# EasyEDA Pro project flopperone.epro

# Schematic Schematic1

## Sheets
1 RP2040: Board Name: Main board; Create Date: 2025-09-06; Page Name: RP2040; Project Name: flopperone; Schematic Name: Schematic1; Update Date: 2025-09-07; Company: EasyEDA.com; Page Size: A4; Version: V1.0
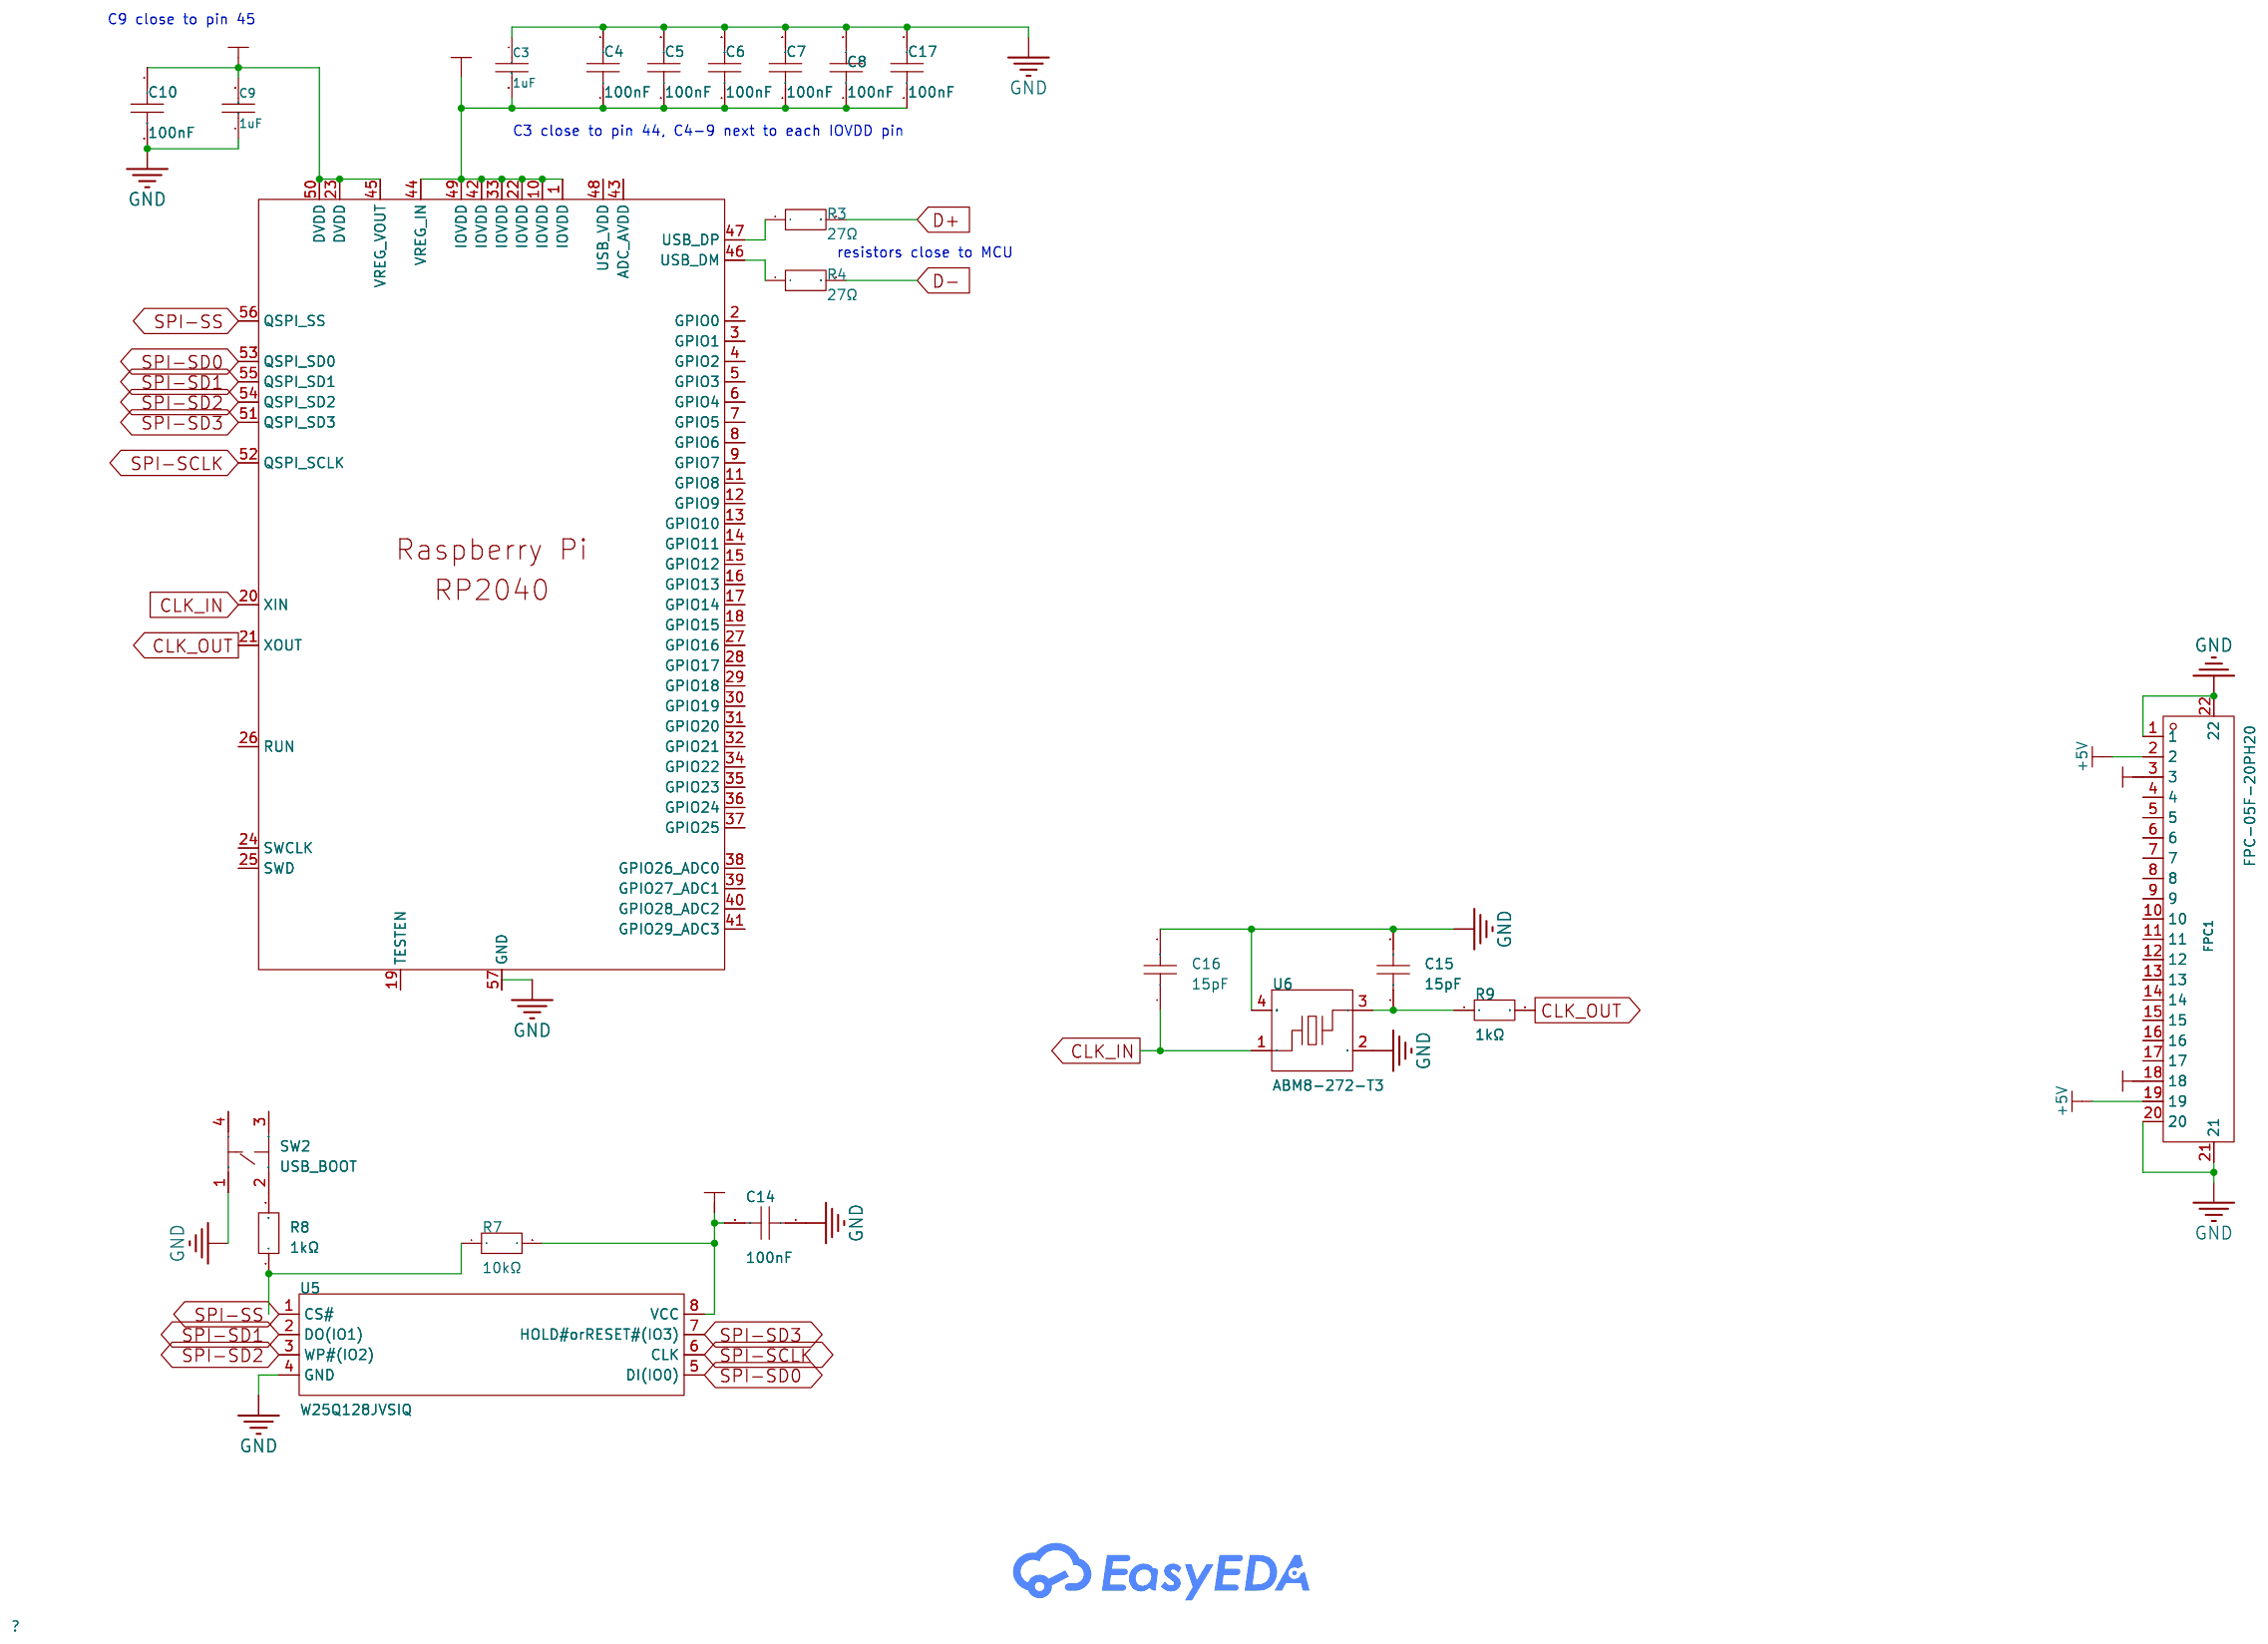
[diagram p0: RP2040]
2 Power: Create Date: 2025-09-07; Page Name: Power
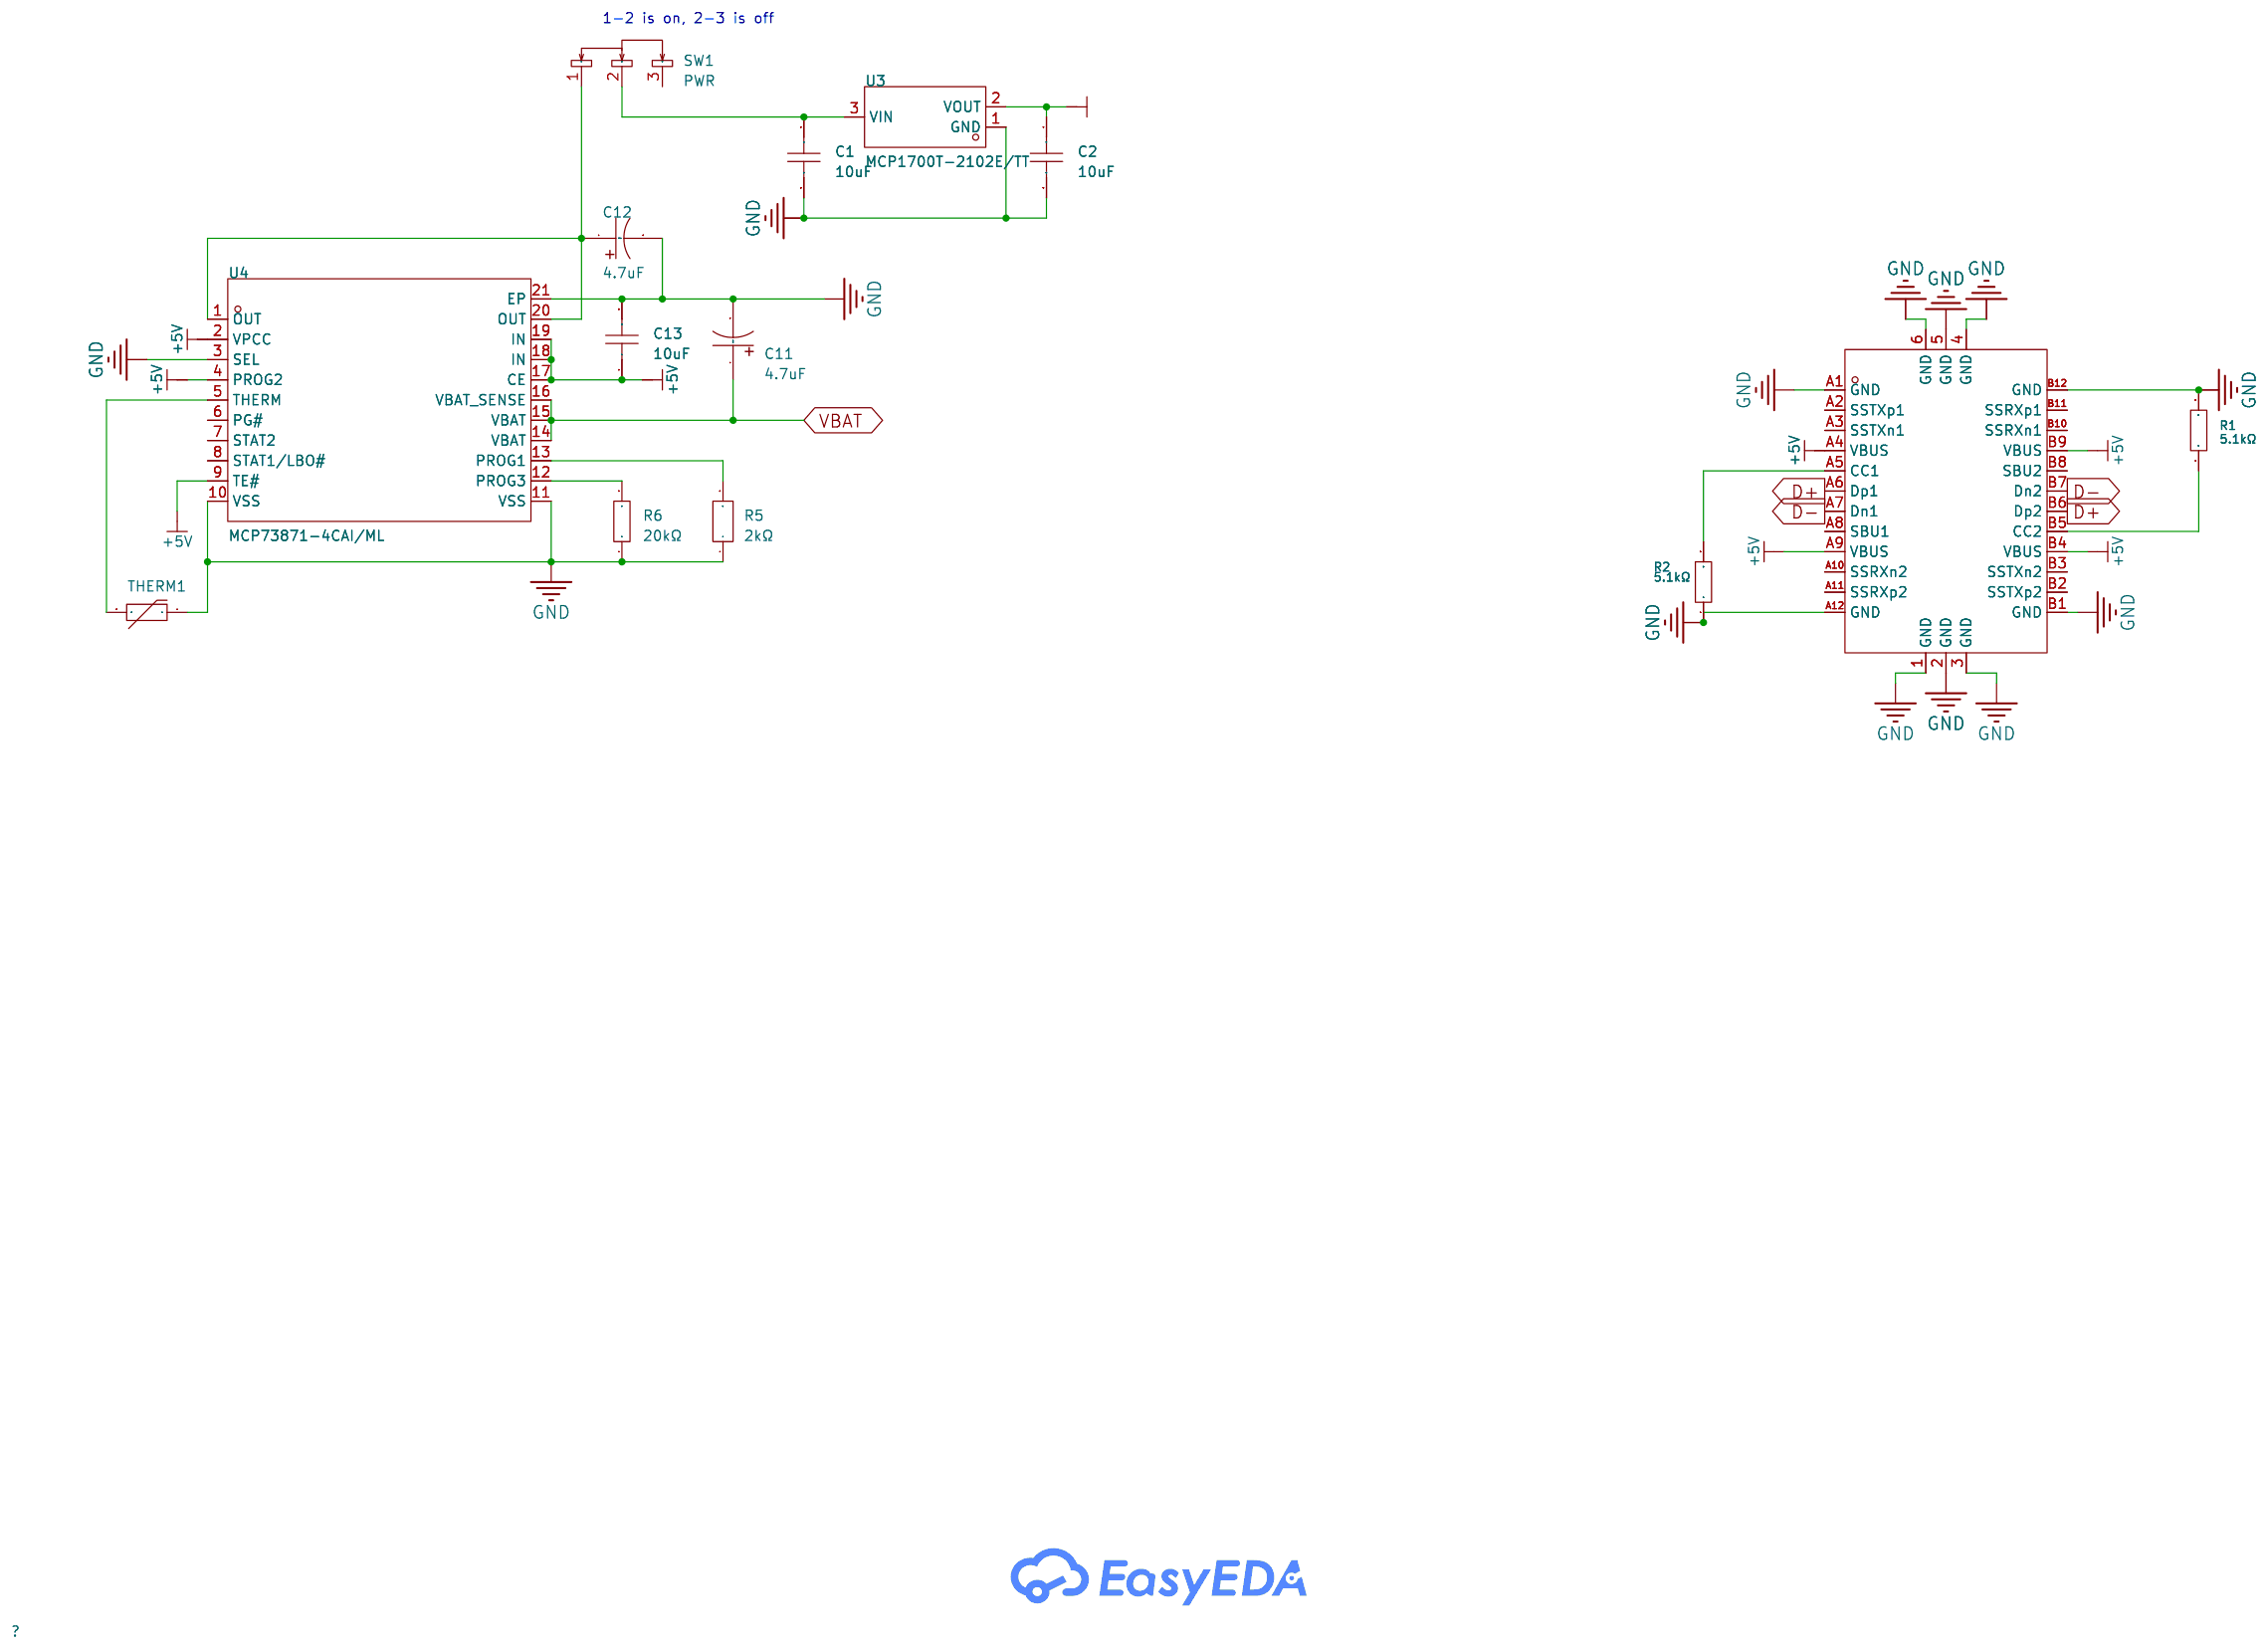
[diagram p1: Power]

## Parts
sheet Power
C1  10uF  [C0805]
C2  10uF  [C0805]
C11  4.7uF  [CAP-SMD_L3.5-W2.8-R-RD]
C12  4.7uF  [CAP-SMD_L3.5-W2.8-R-RD]
C13  10uF  [C0805]
R1  5.1kΩ  [R0402]
R2  5.1kΩ  [R0402]
R5  2kΩ  [R0603]
R6  20kΩ  [R0805]
SW1  PWR  [SW-SMD_MST-12D18G4-SPDT-SLIDE-SWITCH]
THERM1  NCP18XH103F03RB  [R0603]
U3  MCP1700T-2102E/TT  [SOT-23-3P_L2.9-W1.3-LS2.4-P0.95]
U4  MCP73871-4CAI/ML  [QFN-20_L4.0-W4.0-P0.50-TL-EP2.7]
USB1  USB-C40-S-RA-BK-30-TR  [USB-C-SMD_USB-C40-S-RA-BK-30-TR]
sheet RP2040
C3  1uF  [C0805]
C4  100nF  [C0603]
C5  100nF  [C0603]
C6  100nF  [C0603]
C7  100nF  [C0603]
C8  100nF  [C0603]
C9  1uF  [C0805]
C10  100nF  [C0603]
C14  100nF  [C0603]
C15  15pF  [C0402]
C16  15pF  [C0402]
C17  100nF  [C0603]
FPC1  FPC-05F-20PH20  [FPC-SMD_20P-P0.50_XUNPU_FPC-05F-20PH20]
R3  27Ω  [R0603]
R4  27Ω  [R0603]
R7  10kΩ  [R1206]
R8  1kΩ  [R0603]
R9  1kΩ  [R0603]
SW2  USB_BOOT  [SW-SMD_4P-L4.7-W3.6-P1.70-LS6.0]
U1  RP2040  [QFN-56_L7.0-W7.0-P0.40-TL-EP4.0]
U5  W25Q128JVSIQ  [SOIC-8_L5.3-W5.3-P1.27-LS8.0-BL]
U6  ABM8-272-T3  [CRYSTAL-SMD_4P-L3.2-W2.5-BL]

## Library data of the parts
C1 C2 = FCC0805X106K350FT: Capacitance:10uF Tolerance:±10% Tolerance:±10% Voltage Rating:35V Temperature Coefficient:X5R; LCSC Part Name: 10uF ±10% 35V; Supplier Part: C49010152; Manufacturer: FOJAN(富捷); Supplier Footprint: 0805; JLCPCB Part Class: Extended Part; Datasheet: https://item.szlcsc.com/datasheet/FCC0805X106K350FT/51366708.html; Supplier: LCSC; Tolerance: ±10%; Voltage Rating: 35V; Temperature Coefficient: X5R; Check: true
C11 C12 = CA45-B-16V-4.7uF-K: Capacitance:4.7uF Tolerance:±10% Tolerance:±10% Voltage Rating:16V Equivalent Series Resistance(ESR):4Ω@100kHz Operating Temperature:-55℃~+125℃ Operating Temperature:-55℃~+125℃; LCSC Part Name: 4.7uF ±10% 16V; Supplier Part: C140403; Manufacturer: CEC(振华新云); Supplier Footprint: CASE-B-3528-19(mm); JLCPCB Part Class: Extended Part; Datasheet: https://atta.szlcsc.com/upload/public/pdf/source/20171113/C140403_15105612869661115756.pdf; Supplier: LCSC; Tolerance: ±10%; Voltage Rating: 16V; Equivalent Series Resistance(ESR): 4Ω@100kHz; Operating Temperature: -55℃~+125℃
C13 = FCC0805X106K350FT: Capacitance:10uF Tolerance:±10% Tolerance:±10% Voltage Rating:35V Temperature Coefficient:X5R; LCSC Part Name: 10uF ±10% 35V; Supplier Part: C49010152; Manufacturer: FOJAN(富捷); Supplier Footprint: 0805; JLCPCB Part Class: Extended Part; Datasheet: https://item.szlcsc.com/datasheet/FCC0805X106K350FT/51366708.html; Supplier: LCSC; Tolerance: ±10%; Voltage Rating: 35V; Temperature Coefficient: X5R
R1 R2 = RMC04025.1K1%N: Type:Thick Film Resistor Resistance:5.1kΩ Tolerance:±1% Tolerance:±1% Power(Watts):62.5mW Voltage-Supply(Max):50V Temperature Coefficient:±100ppm/℃ Temperature Coefficient:±100ppm/℃ Operating Temperature:-55℃~+155℃ Operating Temperature:-55℃~+155℃; LCSC Part Name: 5.1kΩ ±1% 62.5mW; Supplier Part: C325521; Manufacturer: Tyohm(幸亚电阻); Supplier Footprint: 0402; JLCPCB Part Class: Extended Part; Datasheet: https://item.szlcsc.com/datasheet/RMC04025.1K1%2525N/305726.html; Supplier: LCSC; Type: Thick Film Resistor; Tolerance: ±1%; Power(Watts): 62.5mW; Voltage-Supply(Max): 50V; Temperature Coefficient: ±100ppm/℃; Operating Temperature: -55℃~+155℃; Check: true
R5 = MCT0603PD2001DP500: Type:Thin Film Resistor Resistance:2kΩ Tolerance:±0.5% Tolerance:±0.5% Power(Watts):250mW Voltage-Supply(Max):75V Temperature Coefficient:±25ppm/℃ Temperature Coefficient:±25ppm/℃ Operating Temperature:-55℃~+175℃ Operating Temperature:-55℃~+175℃; LCSC Part Name: 薄膜电阻 2kΩ ±0.5% 250mW; Supplier Part: C2075816; Manufacturer: VISHAY(威世); Supplier Footprint: 0603; JLCPCB Part Class: Extended Part; Datasheet: https://item.szlcsc.com/datasheet/MCT0603PD2001DP500/2167402.html; Supplier: LCSC; Type: Thin Film Resistor; Tolerance: ±0.5%; Power(Watts): 250mW; Voltage-Supply(Max): 75V; Temperature Coefficient: ±25ppm/℃; Operating Temperature: -55℃~+175℃
R6 = RMC 0805 20K F N: Type:Thick Film Resistor Resistance:20kΩ Tolerance:±1% Tolerance:±1% Power(Watts):125mW Voltage-Supply(Max):150V Temperature Coefficient:±100ppm/℃ Temperature Coefficient:±100ppm/℃ Operating Temperature:-55℃~+155℃ Operating Temperature:-55℃~+155℃; LCSC Part Name: 20kΩ ±1% 125mW; Supplier Part: C325760; Manufacturer: Tyohm(幸亚电阻); Supplier Footprint: 0805; JLCPCB Part Class: Extended Part; Datasheet: https://item.szlcsc.com/datasheet/RMC%25200805%252020K%2520F%2520N/305965.html; Supplier: LCSC; Type: Thick Film Resistor; Tolerance: ±1%; Power(Watts): 125mW; Voltage-Supply(Max): 150V; Temperature Coefficient: ±100ppm/℃; Operating Temperature: -55℃~+155℃
SW1 = MST-12D18G4 SPDT Slide Switch: LCSC Part Name: 卧贴两档 滑动开关; Supplier Part: C49023767; Manufacturer: SHOU HAN(首韩); Supplier Footprint: SMD; JLCPCB Part Class: Extended Part; Datasheet: https://item.szlcsc.com/datasheet/MST-12D18G4%2520SPDT%2520Slide%2520Switch/51384142.html; Supplier: LCSC
THERM1 = NCP18XH103F03RB: Resistance @ 25℃:10kΩ B Constant (25℃/50℃):3380K B Constant (25℃/75℃):- B Constant (25℃/85℃):3434K B Constant (25℃/100℃):3455K Power(Watts):100mW B Constant Tolerance:±1% Steady State Current (Max):310uA Operating Temperature:-40℃~+125℃ Operating Temperat; Supplier Part: C13564; Manufacturer: muRata(村田); Supplier Footprint: 0603; JLCPCB Part Class: Extended Part; Datasheet: https://item.szlcsc.com/datasheet/NCP18XH103F03RB/14214.html; Supplier: LCSC; Resistance @ 25℃: 10kΩ; B Constant (25℃/50℃): 3380K; B Constant (25℃/85℃): 3434K; B Constant (25℃/100℃): 3455K; Power(Watts): 100mW; B Constant Tolerance: ±1%; Steady State Current (Max): 310uA; Operating Temperature: -40℃~+125℃
U3 = MCP1700T-2102E/TT: Supplier Part: C625342; Manufacturer: MICROCHIP(美国微芯); Supplier Footprint: SOT-23; JLCPCB Part Class: Extended Part; Datasheet: https://atta.szlcsc.com/upload/public/pdf/source/20210128/C185558_24346100B3C20BAA9E500022156BB257.pdf; Supplier: LCSC; Check: true
U4 = MCP73871-4CAI/ML: The Chip Type:- Voltage - Supply:4.6V~6V Voltage - Supply:4.6V~6V Charge Current - Max:- Charging Saturation Voltage:4.4V Type of Battery:Lithium-ion/Polymer Number of Cells:1 Number of Cells:1 Operating Temperature:-40℃~+85℃ Operating Temperature:-40℃~+8; Supplier Part: C637761; Manufacturer: MICROCHIP(美国微芯); Supplier Footprint: QFN-20-EP(4x4); Datasheet: https://atta.szlcsc.com/upload/public/pdf/source/20221014/8945F1BEA473690BBD91367DBCBEC175.pdf; Supplier: LCSC; Voltage - Supply: 4.6V~6V; Charging Saturation Voltage: 4.4V; Type of Battery: Lithium-ion/Polymer; Number of Cells: 1; Operating Temperature: -40℃~+85℃
USB1 = USB-C40-S-RA-BK-30-TR: Supplier Part: C7095252; Manufacturer: ADAM TECH; Supplier Footprint: 插件; JLCPCB Part Class: Extended Part; Datasheet: https://atta.szlcsc.com/upload/public/pdf/source/20231023/usb-c40-s-ra-bk-30-tr-data-sheet.pdf-799a83ea72a348a63e4b3e0616bdca48.pdf; Supplier: LCSC
C3 C9 = CL21B105KBFNNNE: Capacitance:1uF Tolerance:±10% Tolerance:±10% Voltage Rating:50V Temperature Coefficient:X7R; LCSC Part Name: 1uF ±10% 50V; Supplier Part: C28323; Manufacturer: SAMSUNG(三星); Supplier Footprint: 0805; Datasheet: https://item.szlcsc.com/datasheet/CL21B105KBFNNNE/29074.html; Supplier: LCSC; Tolerance: ±10%; Voltage Rating: 50V; Temperature Coefficient: X7R; Check: true
C4-C8 C10 C17 = CC0603KRX7R9BB104: Capacitance:100nF Tolerance:±10% Tolerance:±10% Voltage Rating:50V Temperature Coefficient:X7R; LCSC Part Name: 100nF ±10% 50V; Supplier Part: C14663; Manufacturer: YAGEO(国巨); Supplier Footprint: 0603; JLCPCB Part Class: Basic Part; Datasheet: https://item.szlcsc.com/datasheet/CC0603KRX7R9BB104/15331.html; Supplier: LCSC; Tolerance: ±10%; Voltage Rating: 50V; Temperature Coefficient: X7R; Check: true
C14 = CC0603KRX7R9BB104: Capacitance:100nF Tolerance:±10% Tolerance:±10% Voltage Rating:50V Temperature Coefficient:X7R; LCSC Part Name: 100nF ±10% 50V; Supplier Part: C14663; Manufacturer: YAGEO(国巨); Supplier Footprint: 0603; JLCPCB Part Class: Basic Part; Datasheet: https://item.szlcsc.com/datasheet/CC0603KRX7R9BB104/15331.html; Supplier: LCSC; Tolerance: ±10%; Voltage Rating: 50V; Temperature Coefficient: X7R
C15 C16 = AC0402JRNPO9BN150: Capacitance:15pF Tolerance:±5% Tolerance:±5% Voltage Rating:50V Temperature Coefficient:NP0; LCSC Part Name: 15pF ±5% 50V; Supplier Part: C513575; Manufacturer: YAGEO(国巨); Supplier Footprint: 0402; JLCPCB Part Class: Extended Part; Datasheet: https://item.szlcsc.com/datasheet/AC0402JRNPO9BN150/528402.html; Supplier: LCSC; Tolerance: ±5%; Voltage Rating: 50V; Temperature Coefficient: NP0
FPC1 = FPC-05F-20PH20: Locking Feature:Hinged Lid Contact Type:Surface Mount Number of Contacts:20P Pitch:0.5mm Mounting Type:Bottom Contact FFC, FCB Thickness:0.3mm FFC, FCB Thickness:0.3mm Height Above Board:2mm Contact Material:Phosphor Bronze Contact Plating:Tin Operating T; LCSC Part Name: 翻盖式 卧贴 P数:20P 间距:0.5mm; Supplier Part: C2856803; Manufacturer: XUNPU(讯普); Supplier Footprint: SMD,P=0.5mm,卧贴; Datasheet: https://item.szlcsc.com/datasheet/FPC-05F-20PH20/3056901.html; Supplier: LCSC; Locking Feature: Hinged Lid; Contact Type: Surface Mount; Number of Contacts: 20P; Pitch: 0.5mm; Mounting Type: Bottom Contact; FFC, FCB Thickness: 0.3mm; Height Above Board: 2mm; Contact Material: Phosphor Bronze; Contact Plating: Tin; Operating Temperature: -25℃~+85℃; Rated Voltage (Max): 50V; Current Rating (Max): 500mA; Check: true
R3 R4 = FRC0603F27R0TS: Type:Thick Film Resistor Resistance:27Ω Tolerance:±1% Tolerance:±1% Power(Watts):100mW Voltage-Supply(Max):75V Temperature Coefficient:±100ppm/℃ Temperature Coefficient:±100ppm/℃ Operating Temperature:-55℃~+155℃ Operating Temperature:-55℃~+155℃; LCSC Part Name: 27Ω ±1% 100mW 厚膜电阻; Supplier Part: C2907021; Manufacturer: FOJAN(富捷); Supplier Footprint: 0603; JLCPCB Part Class: Extended Part; Datasheet: https://item.szlcsc.com/datasheet/FRC0603F27R0TS/3180534.html; Supplier: LCSC; Type: Thick Film Resistor; Tolerance: ±1%; Power(Watts): 100mW; Voltage-Supply(Max): 75V; Temperature Coefficient: ±100ppm/℃; Operating Temperature: -55℃~+155℃; Check: true
R7 = RT1206BRE0710KL: Type:Thin Film Resistor Resistance:10kΩ Tolerance:±0.1% Tolerance:±0.1% Power(Watts):250mW Temperature Coefficient:±50ppm/℃ Temperature Coefficient:±50ppm/℃ Operating Temperature:-55℃~+155℃ Operating Temperature:-55℃~+155℃; LCSC Part Name: 薄膜电阻 10kΩ ±0.1% 250mW; Supplier Part: C870969; Manufacturer: YAGEO(国巨); Supplier Footprint: 1206; JLCPCB Part Class: Extended Part; Datasheet: https://item.szlcsc.com/datasheet/RT1206BRE0710KL/931064.html; Supplier: LCSC; Type: Thin Film Resistor; Tolerance: ±0.1%; Power(Watts): 250mW; Temperature Coefficient: ±50ppm/℃; Operating Temperature: -55℃~+155℃
R8 R9 = CR-03JL7----1K: Resistance:1kΩ Tolerance:±5% Tolerance:±5%; LCSC Part Name: AR.VK.0603.CR102J; Supplier Part: C217299; Manufacturer: Viking(光颉); Supplier Footprint: 0603; Datasheet: https://atta.szlcsc.com/upload/public/pdf/source/20200115/C216905_D92DBD470147666CD03E6E46DFE76923.pdf; Supplier: LCSC; Tolerance: ±5%
SW2 = CS4E251110: Circuit:SPST Actuator Style:Rectangular Button Operating Force:2.5N Mounting Type:- Length:4.7mm Width:3.5mm Switch Height:2.5mm Contact Current:50mA Voltage Rating:12V Actuator/Cap Color:Black With Lamp:No Life:500,000 Cycles Operating Temperature:-25℃~+; LCSC Part Name: 3.5*4.7*2.5梅花硅胶柄U型脚正按中龟轻触开关 180gf; Supplier Part: C41416695; Manufacturer: SAMZO(三佐); Supplier Footprint: SMD-4P,4.7x3.6mm; Datasheet: https://item.szlcsc.com/datasheet/CS4E251110/43240411.html; Supplier: LCSC; Circuit: SPST; Actuator Style: Rectangular Button; Operating Force: 2.5N; Length: 4.7mm; Width: 3.5mm; Switch Height: 2.5mm; Contact Current: 50mA; Voltage Rating: 12V; Actuator/Cap Color: Black; With Lamp: No; Life: 500,000 Cycles; Operating Temperature: -25℃~+85℃
U1 = RP2040: Supplier Part: C2961140; Manufacturer: Raspberry Pi(树莓派); Supplier Footprint: QFN-56-EP(7x7); JLCPCB Part Class: Extended Part; Datasheet: https://atta.szlcsc.com/upload/public/pdf/source/20220208/8D54DD1C91A7987165C42A5C4D6BB336.pdf; Supplier: LCSC; Check: true
U5 = W25Q128JVSIQ_C113767: Interface:SPI Memory Size:- Clock Frequency:133MHz Voltage - Supply:2.7V~3.6V Voltage - Supply:2.7V~3.6V Program / Erase Cycles:100,000 Cycles Page Programming Time (Tpp):3ms Operating Temperature:- Operating Temperature:-; LCSC Part Name: 支持双路/四路SPI接口的3V、128Mbit 串行闪存; Supplier Part: C113767; Manufacturer: Winbond(华邦); Supplier Footprint: SOIC-8-208mil; Datasheet: https://item.szlcsc.com/datasheet/W25Q128JVSIQ/115003.html; Supplier: LCSC; Interface: SPI; Clock Frequency: 133MHz; Voltage - Supply: 2.7V~3.6V; Program / Erase Cycles: 100,000 Cycles; Page Programming Time (Tpp): 3ms
U6 = ABM8-272-T3_C20625731: Supplier Part: C20625731; Manufacturer: ABRACON; Supplier Footprint: SMD3225-4P; Datasheet: https://atta.szlcsc.com/upload/public/pdf/source/20240227/A8BE43F636D80F75C9AF5C59EDF21E9A.pdf; Supplier: LCSC

## Nets
1V1: C9.2 C10.1 U1.23(DVDD) U1.45(VREG_VOUT) U1.50(DVDD)
3V3: C2.1 C3.2 C4.1 C5.1 C6.1 C7.1 C8.1 C14.2 C17.1 FPC1.3 FPC1.18 R7.2 U1.1(IOVDD) U1.10(IOVDD) U1.22(IOVDD) U1.33(IOVDD) U1.42(IOVDD) U1.44(VREG_IN) U1.49(IOVDD) U3.2(VOUT) U5.8(VCC)
+5V: C13.1 FPC1.2 FPC1.19 U4.2(VPCC) U4.4(PROG2) U4.9(TE#) U4.17(CE) U4.18(IN) U4.19(IN) USB1.A4(VBUS) USB1.A9(VBUS) USB1.B4(VBUS) USB1.B9(VBUS)
GND: C1.2 C2.2 C3.1 C4.2 C5.2 C6.2 C7.2 C8.2 C9.1 C10.2 C11.2 C12.2 C13.2 C14.1 C15.2 C16.2 C17.2 FPC1.1 FPC1.20 FPC1.21 FPC1.22 R1.2 R2.1 R5.1 R6.1 SW2.1 THERM1.1 U1.57(GND) U3.1(GND) U4.3(SEL) U4.10(VSS) U4.11(VSS) U4.21(EP) U5.4(GND) U6.2(GND) U6.4(GND) USB1.1(GND) USB1.2(GND) USB1.3(GND) USB1.4(GND) USB1.5(GND) USB1.6(GND) USB1.A1(GND) USB1.A12(GND) USB1.B1(GND) USB1.B12(GND)
VBAT: C11.1 U4.14(VBAT) U4.15(VBAT) U4.16(VBAT_SENSE)
CLK_IN: C16.1 U1.20(XIN) U6.1
CLK_OUT: R9.2 U1.21(XOUT)
D+: R3.2 USB1.A6(Dp1) USB1.B6(Dp2)
D-: R4.2 USB1.A7(Dn1) USB1.B7(Dn2)
SPI-SCLK: U1.52(QSPI_SCLK) U5.6(CLK)
SPI-SD0: U1.53(QSPI_SD0) U5.5(DI(IO0))
SPI-SD1: U1.55(QSPI_SD1) U5.2(DO(IO1))
SPI-SD2: U1.54(QSPI_SD2) U5.3(WP#(IO2))
SPI-SD3: U1.51(QSPI_SD3) U5.7(HOLD#orRESET#(IO3))
SPI-SS: U1.56(QSPI_SS) U5.1(CS#)
$1N2187: R3.1 U1.47(USB_DP)
$1N2233: R4.1 U1.46(USB_DM)
$1N5725: R7.1 R8.1
$1N5875: R8.2 SW2.2
$1N6119: C15.1 R9.1 U6.3
$3N744: R2.2 USB1.A5(CC1)
$3N745: R1.1 USB1.B5(CC2)
$3N1232: R5.2 U4.13(PROG1)
$3N1371: R6.2 U4.12(PROG3)
$3N1610: C12.1 SW1.1 U4.1(OUT) U4.20(OUT)
$3N1613: C1.1 SW1.2 U3.3(VIN)
$3N1672: THERM1.2 U4.5(THERM)

Not connected (* = marked no-connect by the designer): FPC1 4 5 6 7 8 9 10 11 12 13 14 15 16 17; SW1 3; SW2 3 4; U1 2(GPIO0) 3(GPIO1) 4(GPIO2) 5(GPIO3) 6(GPIO4) 7(GPIO5) 8(GPIO6) 9(GPIO7) 11(GPIO8) 12(GPIO9) 13(GPIO10) 14(GPIO11) 15(GPIO12) 16(GPIO13) 17(GPIO14) 18(GPIO15) 19(TESTEN) 24(SWCLK) 25(SWD) 26(RUN) 27(GPIO16) 28(GPIO17) 29(GPIO18) 30(GPIO19) 31(GPIO20) 32(GPIO21) 34(GPIO22) 35(GPIO23) 36(GPIO24) 37(GPIO25) 38(GPIO26_ADC0) 39(GPIO27_ADC1) 40(GPIO28_ADC2) 41(GPIO29_ADC3) 43(ADC_AVDD) 48(USB_VDD); U4 6(PG#) 7(STAT2) 8(STAT1/LBO#); USB1 A2(SSTXp1) A3(SSTXn1) A8(SBU1) A10(SSRXn2) A11(SSRXp2) B2(SSTXp2) B3(SSTXn2) B8(SBU2) B10(SSRXn1) B11(SSRXp1)

## Notes on the sheets
sheet 1
- C9 close to pin 45
- C3 close to pin 44, C4-9 next to each IOVDD pin
- resistors close to MCU
sheet 2
- 1-2 is on, 2-3 is off

# Schematic Schematic2
Board Name: antenna board; Create Date: 2025-09-07; Page Name: P1; Project Name: flopperone; Schematic Name: Schematic2; Update Date: 2025-09-07; Company: EasyEDA.com; Page Size: A4; Version: V1.0
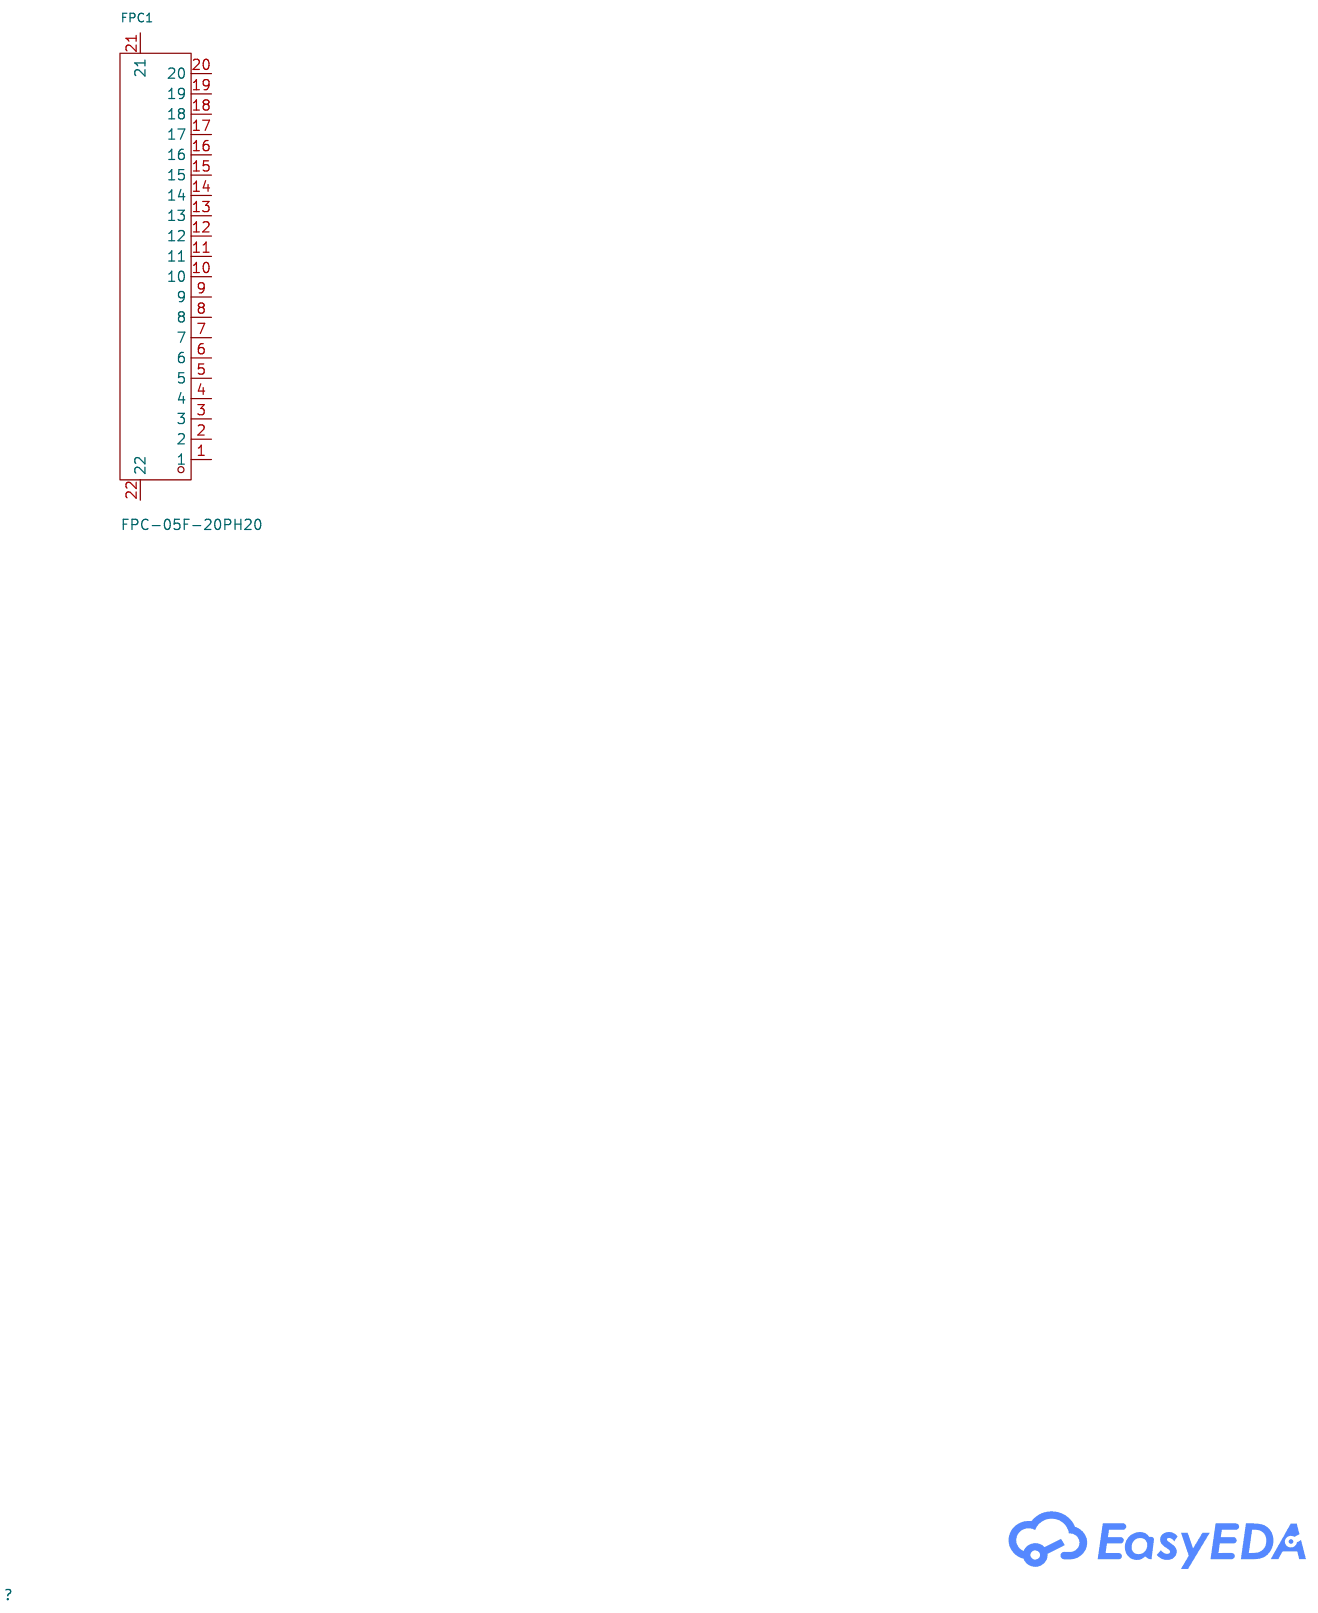
[diagram p2: schematic sheet]

## Parts
FPC1  FPC-05F-20PH20  [FPC-SMD_20P-P0.50_XUNPU_FPC-05F-20PH20]

## Library data of the parts
FPC1 = FPC-05F-20PH20: Locking Feature:Hinged Lid Contact Type:Surface Mount Number of Contacts:20P Pitch:0.5mm Mounting Type:Bottom Contact FFC, FCB Thickness:0.3mm FFC, FCB Thickness:0.3mm Height Above Board:2mm Contact Material:Phosphor Bronze Contact Plating:Tin Operating T; LCSC Part Name: 翻盖式 卧贴 P数:20P 间距:0.5mm; Supplier Part: C2856803; Manufacturer: XUNPU(讯普); Supplier Footprint: SMD,P=0.5mm,卧贴; Datasheet: https://item.szlcsc.com/datasheet/FPC-05F-20PH20/3056901.html; Supplier: LCSC; Locking Feature: Hinged Lid; Contact Type: Surface Mount; Number of Contacts: 20P; Pitch: 0.5mm; Mounting Type: Bottom Contact; FFC, FCB Thickness: 0.3mm; Height Above Board: 2mm; Contact Material: Phosphor Bronze; Contact Plating: Tin; Operating Temperature: -25℃~+85℃; Rated Voltage (Max): 50V; Current Rating (Max): 500mA

## Nets

Not connected (* = marked no-connect by the designer): FPC1 1 2 3 4 5 6 7 8 9 10 11 12 13 14 15 16 17 18 19 20 21 22

# Board PCB1
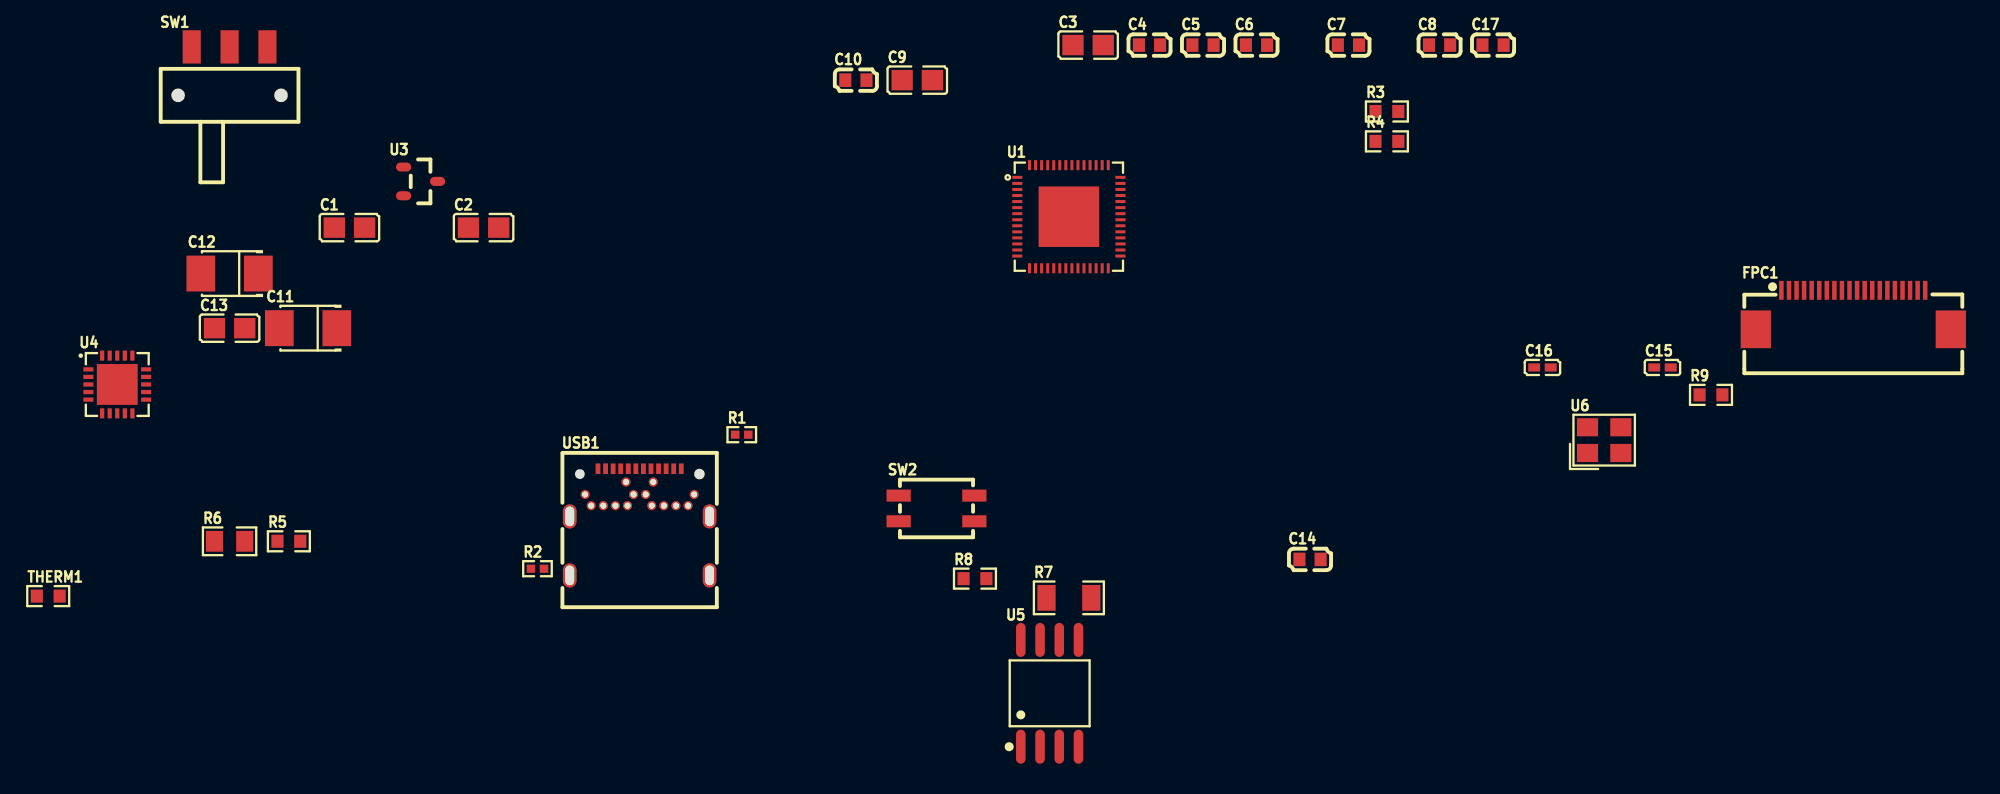
[diagram p3: board, top side]
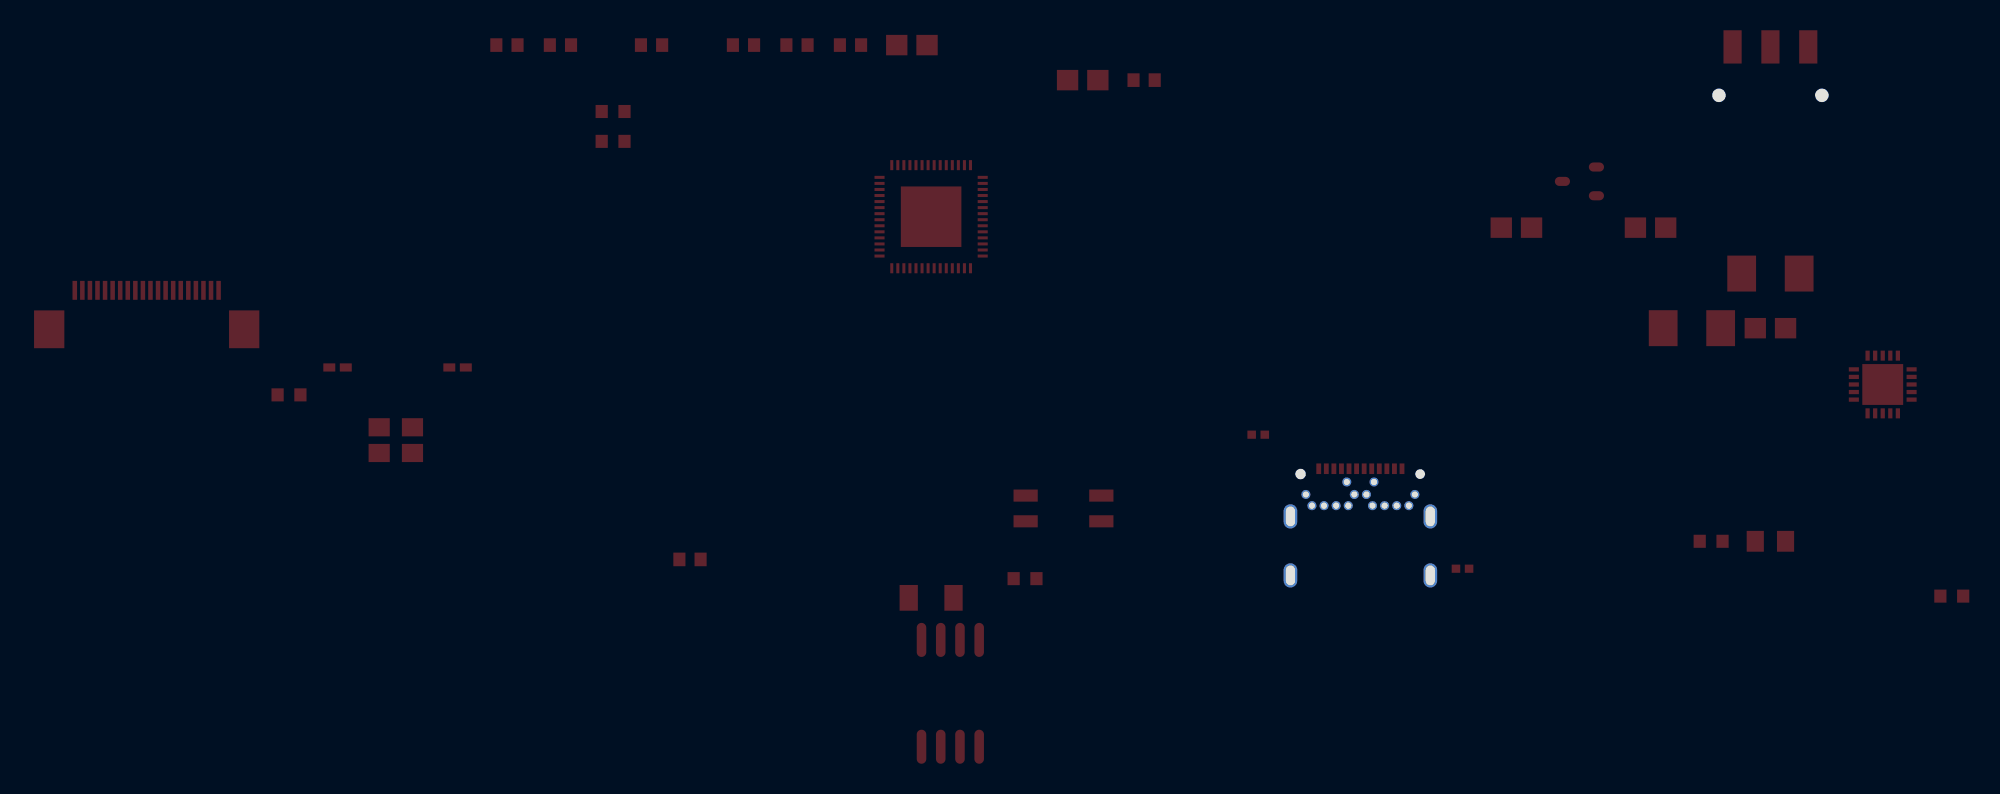
[diagram p4: board, bottom side, seen from below]

Outline 35.23 x 25.83 mm; copper layers: Top Layer, Bottom Layer. Coordinates in mm from the lower left corner of the outline.
Stack: Top Layer 0.035mm / Dielectric1 1.51mm FR4 er 4.5 / Bottom Layer 0.035mm

## Design rules (mm)
template: JLCPCB Capability(Two Layers Board)
spacing copperThickness1oz (default): track to track 0.102, other pairs 0.152 to 0.3
spacing copperThickness2oz: track to track 0.203, other pairs 0.152 to 0.3
track width copperThickness1oz (default): min 0.127, default 0.254, max 2.54
track width copperThickness2oz: min 0.203, default 0.254, max 2.54
differential pair differentialPair (default): width min 0.127, default 0.254, max 2.54; gap min 0.152, default 0.152
via viaSize (default): diameter min 0.5, default 0.61, max 10; hole min 0.3, default 0.305, max 6.3

## Placement (name value [footprint] x y rotation side)
C1  10uF  [C0805]  11.76 16.63 0 top
C2  10uF  [C0805]  20.63 16.63 0 top
C3  1uF  [C0805]  60.56 28.7 0 top
C4  100nF  [C0603]  64.61 28.7 0 top
C5  100nF  [C0603]  68.15 28.7 0 top
C6  100nF  [C0603]  71.68 28.7 0 top
C7  100nF  [C0603]  77.76 28.7 0 top
C8  100nF  [C0603]  83.77 28.7 0 top
C9  1uF  [C0805]  49.27 26.38 0 top
C10  100nF  [C0603]  45.22 26.38 0 top
C11  4.7uF  [CAP-SMD_L3.5-W2.8-R-RD]  9.03 9.99 0 top
C12  4.7uF  [CAP-SMD_L3.5-W2.8-R-RD]  3.85 13.6 0 top
C13  10uF  [C0805]  3.85 9.99 0 top
C14  100nF  [C0603]  75.22 -5.3 0 top
C15  15pF  [C0402]  98.5 7.39 0 top
C16  15pF  [C0402]  90.57 7.39 0 top
C17  100nF  [C0603]  87.31 28.7 0 top
FPC1  FPC-05F-20PH20  [FPC-SMD_20P-P0.50_XUNPU_FPC-05F-20PH20]  111.11 11.2 0 top
R1  5.1kΩ  [R0402]  37.68 2.95 0 top
R2  5.1kΩ  [R0402]  24.19 -5.91 0 top
R3  27Ω  [R0603]  80.3 24.31 0 top
R4  27Ω  [R0603]  80.3 22.34 0 top
R5  2kΩ  [R0603]  7.76 -4.1 0 top
R6  20kΩ  [R0805]  3.85 -4.1 0 top
R7  10kΩ  [R1206]  59.29 -7.84 0 top
R8  1kΩ  [R0603]  53.08 -6.57 0 top
R9  1kΩ  [R0603]  101.7 5.58 0 top
SW1  PWR  [SW-SMD_MST-12D18G4-SPDT-SLIDE-SWITCH]  3.85 28.58 0 top
SW2  USB_BOOT  [SW-SMD_4P-L4.7-W3.6-P1.70-LS6.0]  50.54 -1.93 0 top
THERM1  NCP18XH103F03RB  [R0603]  -8.13 -7.72 0 top
U1  RP2040  [QFN-56_L7.0-W7.0-P0.40-TL-EP4.0]  59.29 17.36 0 top
U3  MCP1700T-2102E/TT  [SOT-23-3P_L2.9-W1.3-LS2.4-P0.95]  16.46 19.69 0 top
U4  MCP73871-4CAI/ML  [QFN-20_L4.0-W4.0-P0.50-TL-EP2.7]  -3.57 6.27 0 top
U5  W25Q128JVSIQ  [SOIC-8_L5.3-W5.3-P1.27-LS8.0-BL]  58.02 -14.15 0 top
U6  ABM8-272-T3  [CRYSTAL-SMD_4P-L3.2-W2.5-BL]  94.65 2.59 0 top
USB1  USB-C40-S-RA-BK-30-TR  [USB-C-SMD_USB-C40-S-RA-BK-30-TR]  30.93 -2.83 0 top

## Footprints (pads in the part's own frame, mm; a bottom-side part is the same pattern mirrored in y, then rotated)
C0402
  rect 0.79x0.54 smd: 1(-0.545,0) 2(0.545,0)
C0603
  rect 0.8x0.9 smd: 1(-0.7,0) 2(0.7,0)
C0805
  rect 1.41x1.35 smd: 1(-1,0) 2(1,0)
CAP-SMD_L3.5-W2.8-R-RD
  rect 1.9x2.376 smd: 1(1.899,0) 2(-1.899,0)
CRYSTAL-SMD_4P-L3.2-W2.5-BL
  rect 1.4x1.2 smd: 1(-1.1,-0.85) 2(1.1,-0.85) 3(1.1,0.85) 4(-1.1,0.85)
FPC-SMD_20P-P0.50_XUNPU_FPC-05F-20PH20
  rect 0.3x1.25 smd: 1(-4.75,1.288) 2(-4.25,1.288) 3(-3.75,1.288) 4(-3.25,1.288) 5(-2.75,1.288) 6(-2.25,1.288) 7(-1.75,1.288) 8(-1.25,1.288) 9(-0.75,1.288) 10(-0.25,1.288) 11(0.25,1.288) 12(0.75,1.288) 13(1.25,1.288) 14(1.75,1.288) 15(2.25,1.288) 16(2.75,1.288) 17(3.25,1.288) 18(3.75,1.288) 19(4.25,1.288) 20(4.75,1.288)
  rect 2x2.5 smd: 21(6.44,-1.288) 22(-6.44,-1.288)
QFN-20_L4.0-W4.0-P0.50-TL-EP2.7
  rect 0.665x0.28 smd: 1(-1.907,1) 2(-1.907,0.5) 3(-1.907,0) 4(-1.907,-0.5) 5(-1.907,-1) 11(1.907,-1) 12(1.907,-0.5) 13(1.907,0) 14(1.907,0.5) 15(1.907,1)
  rect 0.28x0.665 smd: 6(-1,-1.907) 7(-0.5,-1.907) 8(0,-1.907) 9(0.5,-1.907) 10(1,-1.907) 16(1,1.907) 17(0.5,1.907) 18(0,1.907) 19(-0.5,1.907) 20(-1,1.907)
  rect 2.7x2.7 smd: 21(0,0)
QFN-56_L7.0-W7.0-P0.40-TL-EP4.0
  rect 0.665x0.2 smd: 1(-3.408,2.6) 2(-3.408,2.2) 3(-3.408,1.8) 4(-3.408,1.4) 5(-3.408,1) 6(-3.408,0.6) 7(-3.408,0.2) 8(-3.408,-0.2) 9(-3.408,-0.6) 10(-3.408,-1) 11(-3.408,-1.4) 12(-3.408,-1.8) 13(-3.408,-2.2) 14(-3.408,-2.6) 29(3.408,-2.6) 30(3.408,-2.2) 31(3.408,-1.8) 32(3.408,-1.4) 33(3.408,-1) 34(3.408,-0.6) 35(3.408,-0.2) 36(3.408,0.2) 37(3.408,0.6) 38(3.408,1) 39(3.408,1.4) 40(3.408,1.8) 41(3.408,2.2) 42(3.408,2.6)
  rect 0.2x0.665 smd: 15(-2.6,-3.408) 16(-2.2,-3.408) 17(-1.8,-3.408) 18(-1.4,-3.408) 19(-1,-3.408) 20(-0.6,-3.408) 21(-0.2,-3.408) 22(0.2,-3.408) 23(0.6,-3.408) 24(1,-3.408) 25(1.4,-3.408) 26(1.8,-3.408) 27(2.2,-3.408) 28(2.6,-3.408) 43(2.6,3.408) 44(2.2,3.408) 45(1.8,3.408) 46(1.4,3.408) 47(1,3.408) 48(0.6,3.408) 49(0.2,3.408) 50(-0.2,3.408) 51(-0.6,3.408) 52(-1,3.408) 53(-1.4,3.408) 54(-1.8,3.408) 55(-2.2,3.408) 56(-2.6,3.408)
  rect 4x4 smd: 57(0,0)
R0402
  rect 0.566x0.54 smd: 1(-0.433,0) 2(0.433,0)
R0603
  rect 0.806x0.864 smd: 1(-0.753,0) 2(0.753,0)
R0805
  rect 1.133x1.377 smd: 1(-1,0) 2(1,0)
R1206
  rect 1.208x1.701 smd: 1(-1.479,0) 2(1.479,0)
SOIC-8_L5.3-W5.3-P1.27-LS8.0-BL
  oval 0.63x2.25 smd: 1(-1.905,-3.53) 2(-0.635,-3.53) 3(0.635,-3.53) 4(1.905,-3.53) 5(1.905,3.53) 6(0.635,3.53) 7(-0.635,3.53) 8(-1.905,3.53)
SOT-23-3P_L2.9-W1.3-LS2.4-P0.95
  oval 1x0.6 smd: 1(-1.123,0.95) 2(-1.123,-0.95) 3(1.123,0)
SW-SMD_4P-L4.7-W3.6-P1.70-LS6.0
  rect 1.6x0.8 smd: 1(-2.5,0.85) 2(-2.5,-0.85) 3(2.5,-0.85) 4(2.5,0.85)
SW-SMD_MST-12D18G4-SPDT-SLIDE-SWITCH
  rect 1.2x2.2 smd: 1(-2.5,0) 2(0,0) 3(2.5,0)
USB-C-SMD_USB-C40-S-RA-BK-30-TR
  oval 0.9x1.6 hole 0.6x1.3: 1(-4.62,0.375) 2(4.62,0.375) 3(-4.62,-3.525) 4(4.62,-3.525)
  round 0.6 hole 0.4: 5(-0.9,2.65) 6(0.9,2.65) B1(3.6,1.825) B2(3.2,1.085) B3(2.4,1.085) B4(1.6,1.085) B5(0.8,1.085) B6(0.4,1.825) B7(-0.4,1.825) B8(-0.8,1.085) B9(-1.6,1.085) B10(-2.4,1.085) B11(-3.2,1.085) B12(-3.6,1.825)
  rect 0.32x0.7 smd: A1(-2.75,3.525) A2(-2.25,3.525) A3(-1.75,3.525) A4(-1.25,3.525) A5(-0.75,3.525) A6(-0.25,3.525) A7(0.25,3.525) A8(0.75,3.525) A9(1.25,3.525) A10(1.75,3.525) A11(2.25,3.525) A12(2.75,3.525)

## Nets
As in the schematic.

Pads without a net: FPC1 4 5 6 7 8 9 10 11 12 13 14 15 16 17; SW1 3; SW2 3 4; U1 2 3 4 5 6 7 8 9 11 12 13 14 15 16 17 18 19 24 25 26 27 28 29 30 31 32 34 35 36 37 38 39 40 41 43 48; U4 6 7 8; USB1 A2 A3 A8 A10 A11 B2 B3 B8 B10 B11
